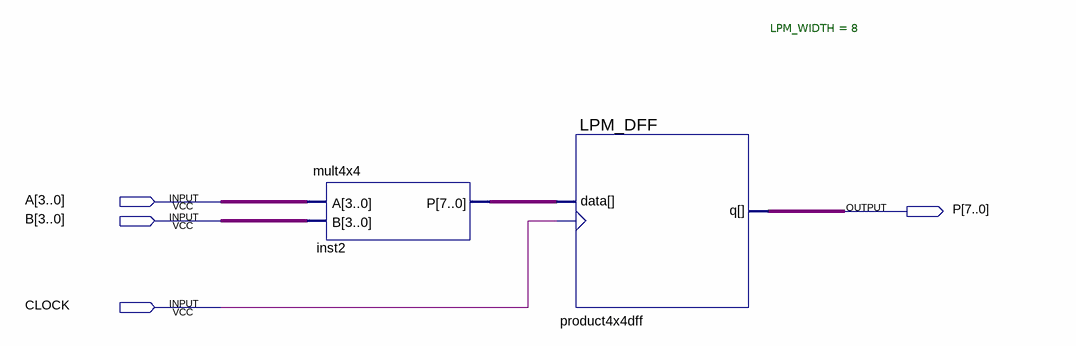
[diagram p0: schematic sheet]
// Quartus schematic clocked4x4.bdf as structural Verilog: 2 symbols, 4 pins
module clocked4x4 (
  input  [3:0] A,
  input  [3:0] B,
  input  CLOCK,
  output [7:0] P
);

  wire [7:0] inst2_p;

  mult4x4 inst2 (.A(A), .B(B), .P(inst2_p));
  LPM_DFF #(.LPM_WIDTH(8)) product4x4dff (.clock(CLOCK), .data(inst2_p), .q(P));
endmodule
